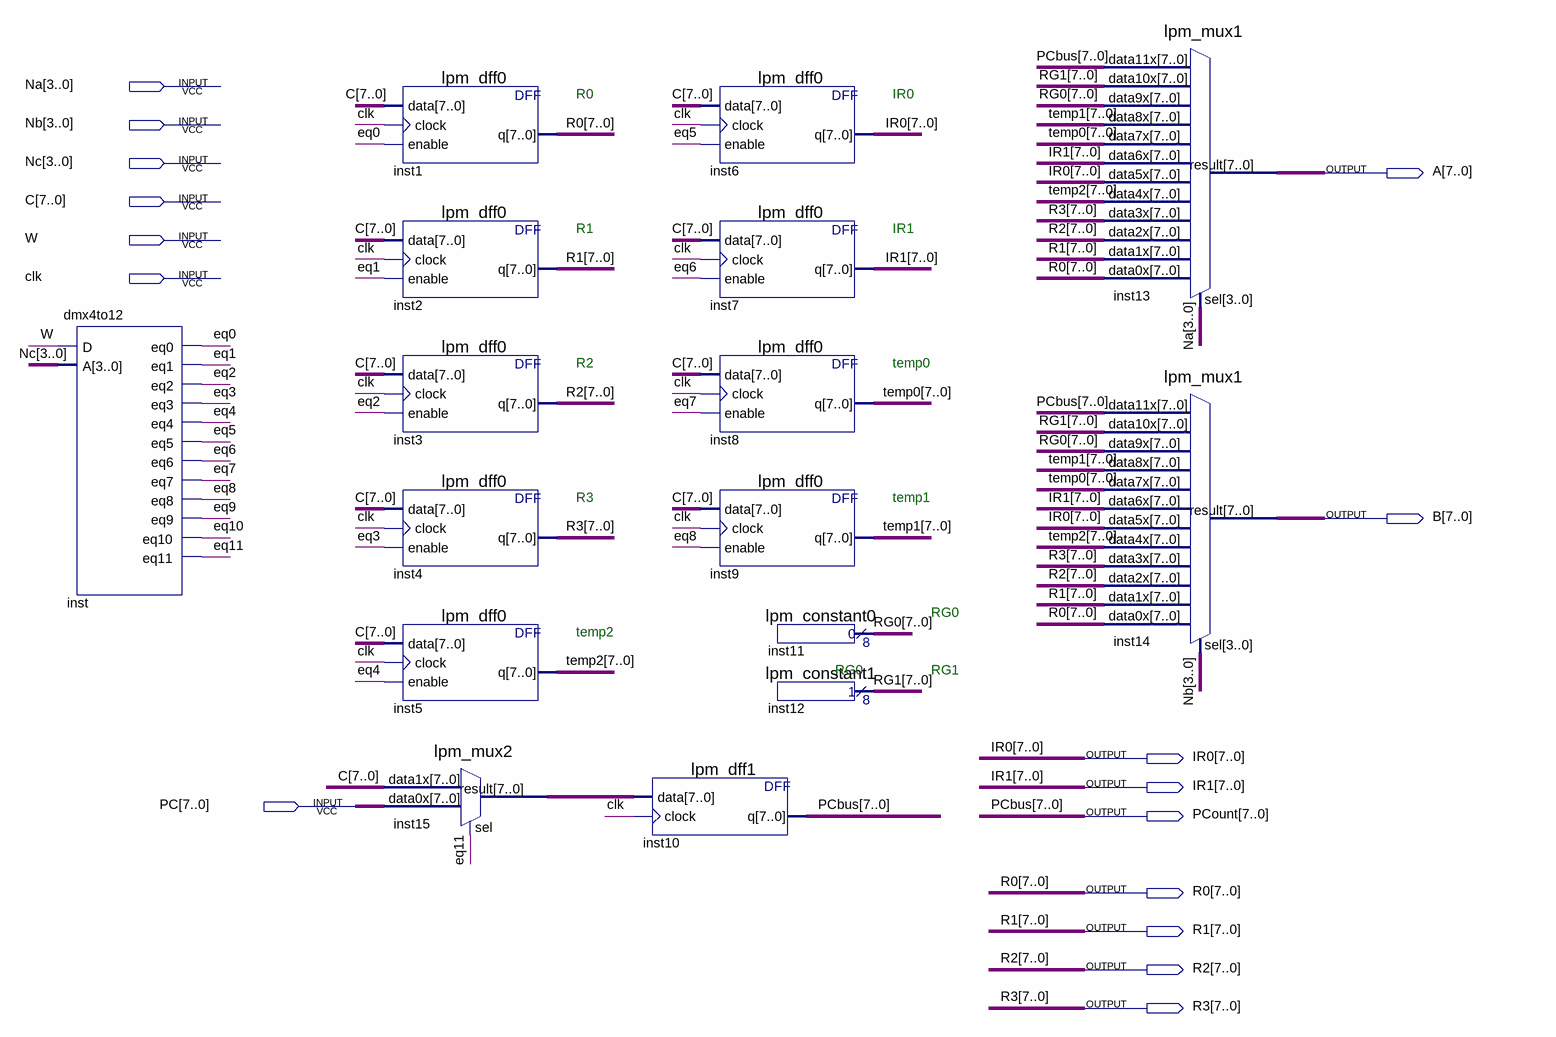
[diagram p0: schematic sheet]
// Quartus schematic GPR.bdf as structural Verilog: 16 symbols, 16 pins
module GPR (
  input  [3:0] Na,
  input  [3:0] Nb,
  input  [3:0] Nc,
  input  [7:0] C,
  input  W,
  input  clk,
  input  [7:0] PC,
  output [7:0] A,
  output [7:0] B,
  output [7:0] IR0,
  output [7:0] IR1,
  output [7:0] PCount,
  output [7:0] R0,
  output [7:0] R1,
  output [7:0] R2,
  output [7:0] R3
);

  wire eq0, eq1, eq2, eq3, eq4, eq5, eq6, eq7, eq8, eq9, eq10, eq11;
  wire [7:0] inst15_result, RG0, RG1, temp0, temp1, temp2;

  dmx4to12 inst (
    .D(W), .A(Nc), .eq0(eq0), .eq1(eq1), .eq2(eq2), .eq3(eq3), .eq4(eq4), .eq5(eq5), .eq6(eq6), .eq7(eq7),
    .eq8(eq8), .eq9(eq9), .eq10(eq10), .eq11(eq11));
  lpm_dff0 inst1 (.data(C), .clock(clk), .enable(eq0), .q(R0));
  lpm_dff0 inst2 (.data(C), .clock(clk), .enable(eq1), .q(R1));
  lpm_dff0 inst3 (.data(C), .clock(clk), .enable(eq2), .q(R2));
  lpm_dff0 inst4 (.data(C), .clock(clk), .enable(eq3), .q(R3));
  lpm_dff0 inst5 (.data(C), .clock(clk), .enable(eq4), .q(temp2));
  lpm_mux2 inst15 (.data1x(C), .data0x(PC), .sel(eq11), .result(inst15_result));
  lpm_dff1 inst10 (.data(inst15_result), .clock(clk), .q(PCount));
  lpm_dff0 inst6 (.data(C), .clock(clk), .enable(eq5), .q(IR0));
  lpm_dff0 inst7 (.data(C), .clock(clk), .enable(eq6), .q(IR1));
  lpm_dff0 inst8 (.data(C), .clock(clk), .enable(eq7), .q(temp0));
  lpm_dff0 inst9 (.data(C), .clock(clk), .enable(eq8), .q(temp1));
  lpm_constant0 inst11 (.result(RG0));
  lpm_constant1 inst12 (.result(RG1));
  lpm_mux1 inst13 (
    .data11x(PCount), .data10x(RG1), .data9x(RG0), .data8x(temp1), .data7x(temp0), .data6x(IR1),
    .data5x(IR0), .data4x(temp2), .data3x(R3), .data2x(R2), .data1x(R1), .data0x(R0), .sel(Na), .result(A));
  lpm_mux1 inst14 (
    .data11x(PCount), .data10x(RG1), .data9x(RG0), .data8x(temp1), .data7x(temp0), .data6x(IR1),
    .data5x(IR0), .data4x(temp2), .data3x(R3), .data2x(R2), .data1x(R1), .data0x(R0), .sel(Nb), .result(B));

  // Other names for the same wires on the sheet: PCbus[7:0] = PCount

  // Notes on the sheet:
  //   R0
  //   IR0
  //   R1
  //   IR1
  //   R2
  //   temp0
  //   R3
  //   temp1
  //   RG0
  //   temp2
  //   RG0
  //   RG1
endmodule
